# EAGLE design display-7-seg (EAGLE 9.1.0)
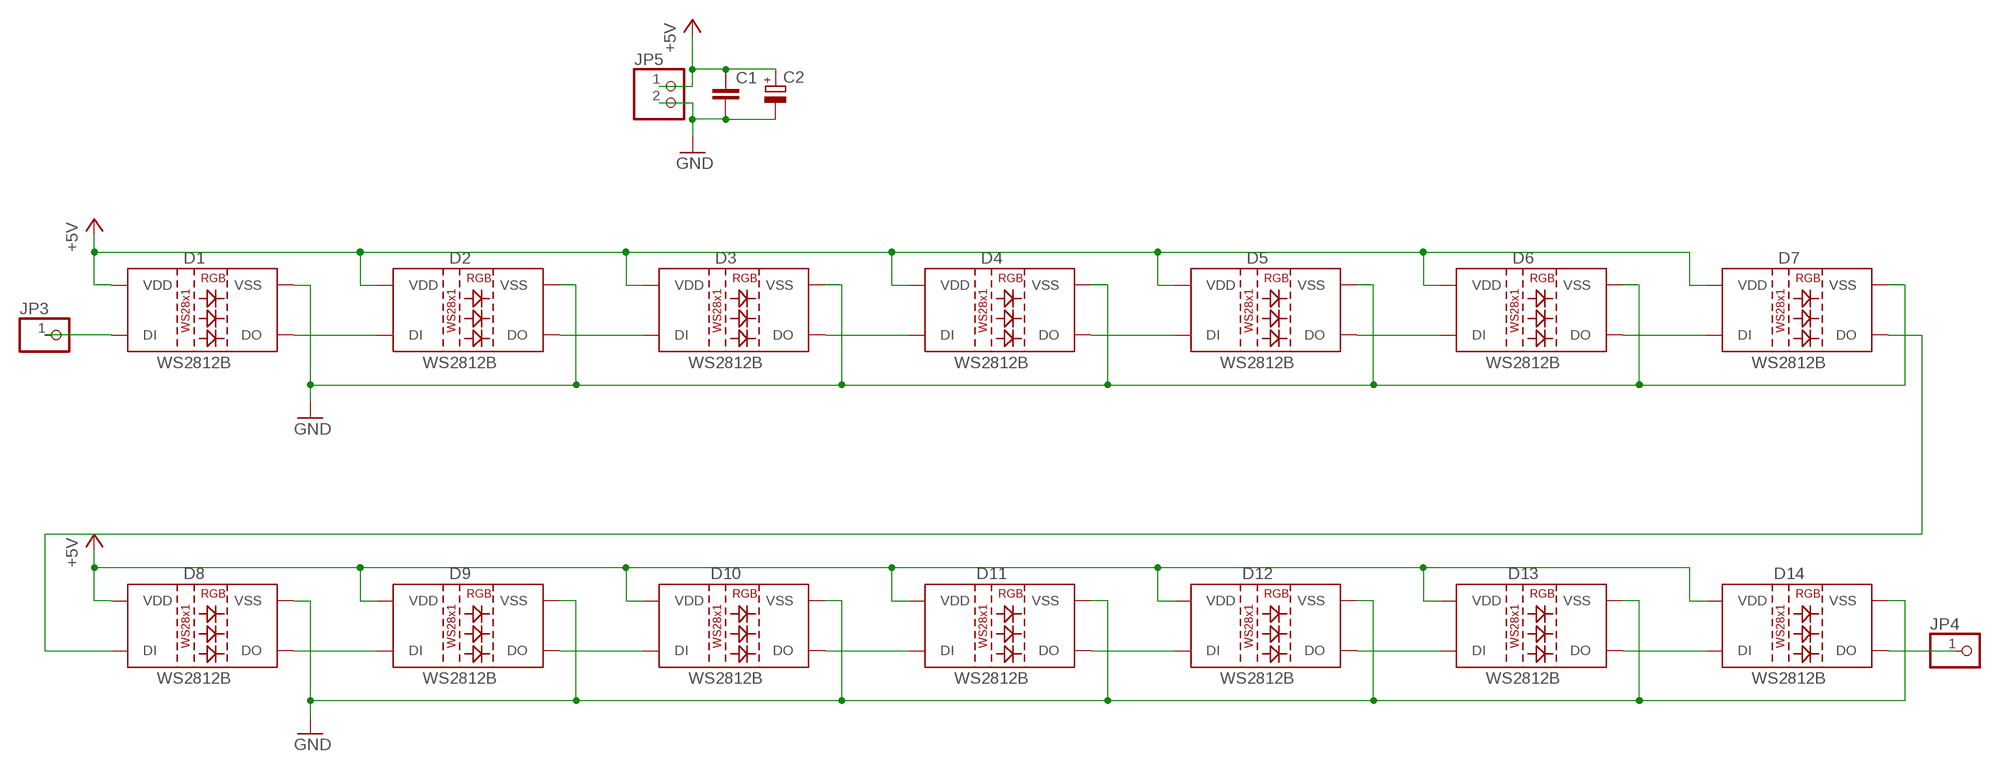
[diagram p0: schematic, sheet 1]

## Parts
C1  C-EUC1206  [C1206]
C2  CPOL-EUE2.5-6  [E2,5-6]
D1  WS2812B  [WS2812B]
D2  WS2812B  [WS2812B]
D3  WS2812B  [WS2812B]
D4  WS2812B  [WS2812B]
D5  WS2812B  [WS2812B]
D6  WS2812B  [WS2812B]
D7  WS2812B  [WS2812B]
D8  WS2812B  [WS2812B]
D9  WS2812B  [WS2812B]
D10  WS2812B  [WS2812B]
D11  WS2812B  [WS2812B]
D12  WS2812B  [WS2812B]
D13  WS2812B  [WS2812B]
D14  WS2812B  [WS2812B]
JP3  PINHD-1X1  [1X01]
JP4  PINHD-1X1  [1X01]
JP5  PINHD-1X2  [1X02]

## Nets
+5V: C1.1 C2.+ D1.1(VDD) D2.1(VDD) D3.1(VDD) D4.1(VDD) D5.1(VDD) D6.1(VDD) D7.1(VDD) D8.1(VDD) D9.1(VDD) D10.1(VDD) D11.1(VDD) D12.1(VDD) D13.1(VDD) D14.1(VDD) JP5.1
GND: C1.2 C2.- D1.3(VSS) D2.3(VSS) D3.3(VSS) D4.3(VSS) D5.3(VSS) D6.3(VSS) D7.3(VSS) D8.3(VSS) D9.3(VSS) D10.3(VSS) D11.3(VSS) D12.3(VSS) D13.3(VSS) D14.3(VSS) JP5.2
N$1: D7.2(DO) D8.4(DI)
N$2: D14.2(DO) JP4.1
N$3: D1.2(DO) D2.4(DI)
N$4: D2.2(DO) D3.4(DI)
N$5: D3.2(DO) D4.4(DI)
N$6: D4.2(DO) D5.4(DI)
N$7: D5.2(DO) D6.4(DI)
N$8: D6.2(DO) D7.4(DI)
N$9: D8.2(DO) D9.4(DI)
N$10: D9.2(DO) D10.4(DI)
N$11: D10.2(DO) D11.4(DI)
N$12: D11.2(DO) D12.4(DI)
N$13: D12.2(DO) D13.4(DI)
N$14: D13.2(DO) D14.4(DI)
N$15: D1.4(DI) JP3.1

## Library data of the parts
C1 = rcl:C-EU: CAPACITOR, European symbol; SPICEPREFIX: C
C2 = rcl:CPOL-EU: POLARIZED CAPACITOR, European symbol; SPICEPREFIX: C
D1-D14 = WS2812B:WS2812B: WS2812B SMD addressable RGB LED 5x5mm SMD LED with built-in controller IC. Color: Red/Green/Blue mC Rating: RGB: 390, 660, 180 mcd Forward Voltage: RGB: 2.0, 3.0, 3.0 V Packages:WS2812B SparkFun Products: Blynk Board - ESP8266 <https://www.sparkfun.com/products/13794>; AVAILABILITY: Unavailable; DESCRIPTION: Intelligent Control Led Integrated Light Source Pack Of 10; MF: Worldsemi; MP: WS2812B; PACKAGE: None; PRICE: None
JP3 JP4 = pinhead:PINHD-1X1: PIN HEADER
JP5 = pinhead:PINHD-1X2: PIN HEADER

## Board
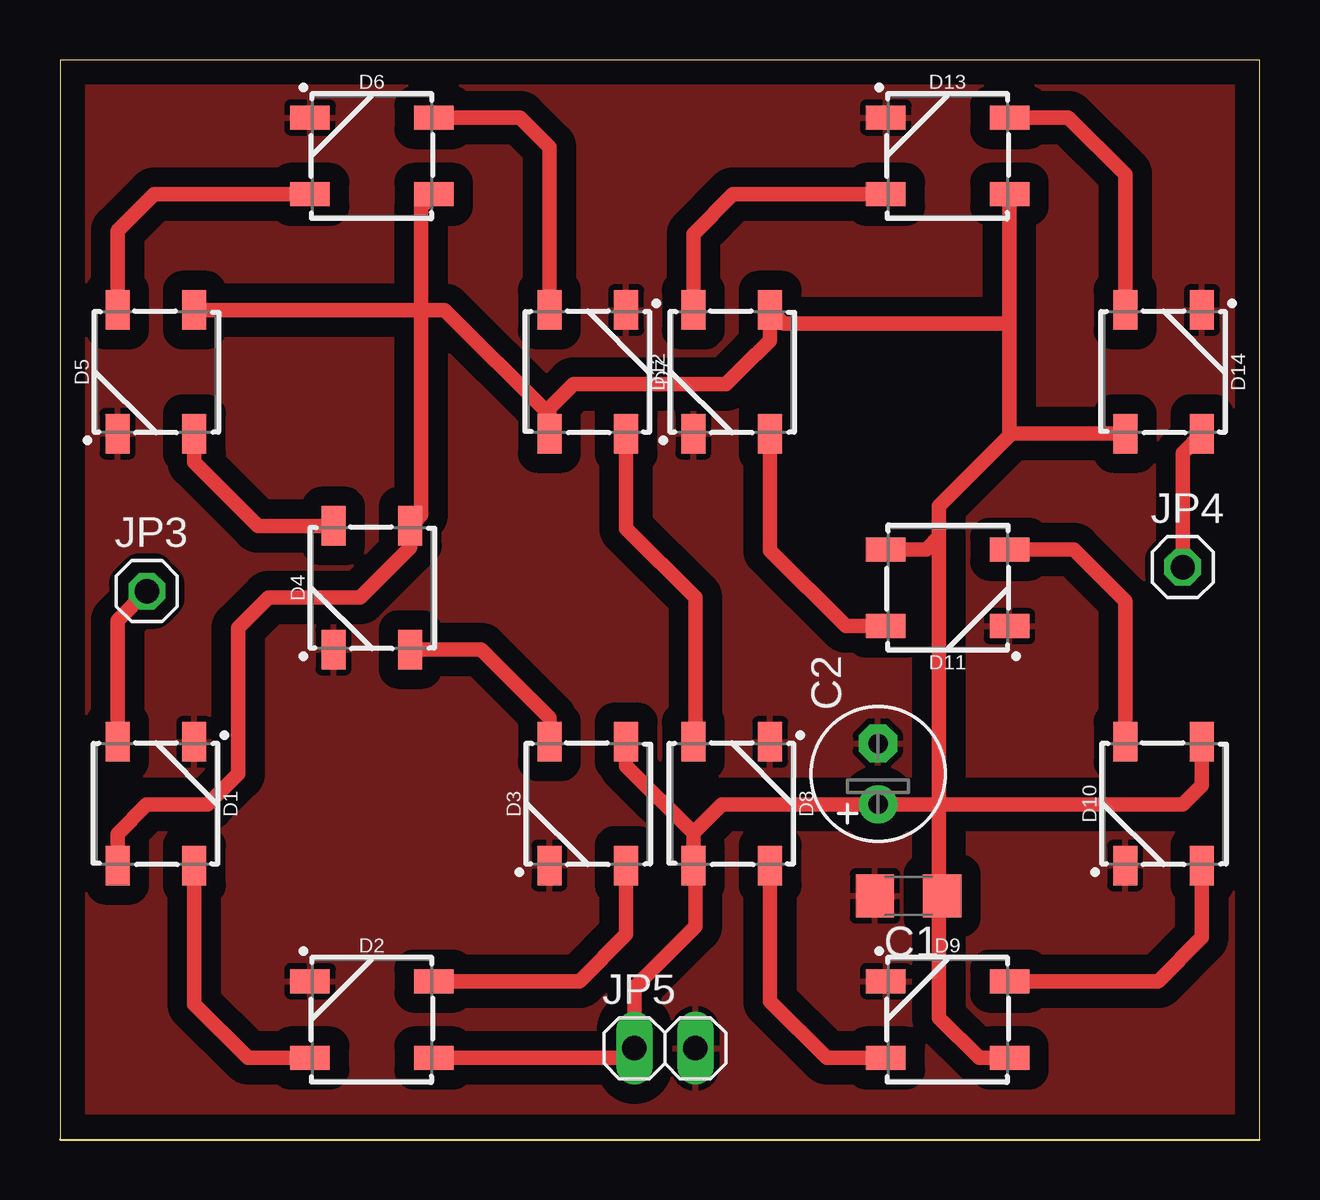
[diagram p1: board, top side]

Size 50 x 45 mm. Coordinates in mm from the lower left corner, seen from the top.
Outline: 50,0 50,45 0,45 0,0 50,0
Copper layers (1*16): Top 0.035mm / dielectric 1.5mm / Bottom 0.035mm
Design rules "default *": minimum track width 6mil, minimum drill 0.35mm, track to track 32mil, track to pad 16mil, pad to pad 24mil, via to via 6mil, smd to smd 6mil, copper to edge 40mil, drill to drill 6mil, minimum pad ring 10mil, minimum via ring 8mil, stop-mask expansion 4mil, vias tented up to drill 0mil, thermal gap 10mil

### Footprints (pad centres in the part's own frame; a part is rotated, then mirrored left to right if it is on the bottom)
C1206 = smd 1.6 x 1.8: 1 -1.4,0; 2 1.4,0
E2,5-6 = drill 0.813 pad 1.6: + -1.27,0 | drill 0.813 pad 1.6 octagon: - 1.27,0
WS2812B = smd 1.651 x 1: 1 2.577,-1.6; 2 2.577,1.6; 3 -2.577,1.6; 4 -2.577,-1.6
1X01 = drill 1.016 octagon: 1 0,0
1X02 = drill 1.016 long: 1 -1.27,0; 2 1.27,0

### Placement (x,y rotation side)
C1  35.37,10.16 180 top
C2  34.1,15.24 90 top
D1  4,14 270 top
D2  13,5 0 top
D3  22,14 90 top
D4  13,23 90 top
D5  4,32 90 top
D6  13,41 0 top
D7  22,32 270 top
D8  28,14 270 top
D9  37,5 0 top
D10  46,14 90 top
D11  37,23 180 top
D12  28,32 90 top
D13  37,41 0 top
D14  46,32 270 top
JP3  3.62,22.86 0 top
JP4  46.8,23.86 0 top
JP5  25.21,3.81 0 top

### Tracks (layer width: path | path; a pad name or v marks a point on that pad's centre or on a via)
+5V
  Top 0.61: D2.1 23.53,3.4 JP5.1 23.94,6.35 26.48,8.89 26.48,11.34 D8.1 26.4,12.78 | D3.1 23.6,15.58 26.4,12.78 | 39.66,29.42 D14.1 | 39.66,29.42 36.64,26.4 36.64,25.13 | 36.64,25.13 36.64,13.97 | D10.1 47.6,14.77 46.8,13.97 36.64,13.97 | D13.1 39.58,34.02 | 39.58,34.02 39.58,29.51 39.66,29.42 | 39.58,34.02 30.16,34.02 D12.1 29.6,33.31 29.02,32.73 29.02,32.75 27.75,31.48 21.4,31.48 20.4,30.48 20.4,30.21 | 20.4,30.21 D7.1 | D5.1 15.05,34.58 | 15.05,34.58 16.03,34.58 20.4,30.21 | D6.1 15.05,38.87 15.05,34.58 | 15.05,34.58 15.05,26.03 D4.1 14.6,24.68 12.51,22.59 8.7,22.59 7.43,21.32 7.43,15.24 6.16,13.97 3.62,13.97 2.4,12.75 D1.1 | D11.1 36.11,24.6 36.64,25.13 | D9.1 38.32,3.4 36.64,5.08 36.64,10.29 | 36.64,13.97 C2.+ 27.59,13.97 26.4,12.78 | 36.64,13.97 36.64,11.56 36.64,10.29 | 36.64,10.29 C1.1
GND
  pour Top: 0,0 50,0 50,45 0,45
N$1
  Top 0.61: D7.2 23.6,25.47 26.48,22.59 26.48,16.66 D8.4
N$2
  Top 0.61: JP4.1 46.8,28.62 D14.2
N$3
  Top 0.61: D2.4 7.84,3.4 5.6,5.64 D1.2
N$4
  Top 0.61: D2.2 21.65,6.6 23.6,8.55 D3.4
N$5
  Top 0.61: D4.4 17.55,20.42 20.4,17.58 D3.2
N$6
  Top 0.61: D4.2 8.25,25.58 5.6,28.23 D5.4
N$7
  Top 0.61: D5.2 2.4,37.88 3.92,39.4 D6.4
N$8
  Top 0.61: D6.2 19.17,42.6 20.4,41.37 D7.4
N$9
  Top 0.61: D8.2 29.6,5.77 31.97,3.4 D9.4
N$10
  Top 0.61: D9.2 45.78,6.6 47.6,8.42 D10.4
N$11
  Top 0.61: D10.2 44.4,22.45 42.25,24.6 D11.4
N$12
  Top 0.61: D11.2 32.75,21.4 29.6,24.55 D12.4
N$13
  Top 0.61: D12.2 26.4,37.75 28.05,39.4 D13.4
N$14
  Top 0.61: D13.2 42.03,42.6 44.4,40.23 D14.4
N$15
  Top 0.61: JP3.1 2.4,21.64 D1.4